# EAGLE schematic QuadQuantizer (EAGLE 8.7.0)

## Sheet 1 of 2
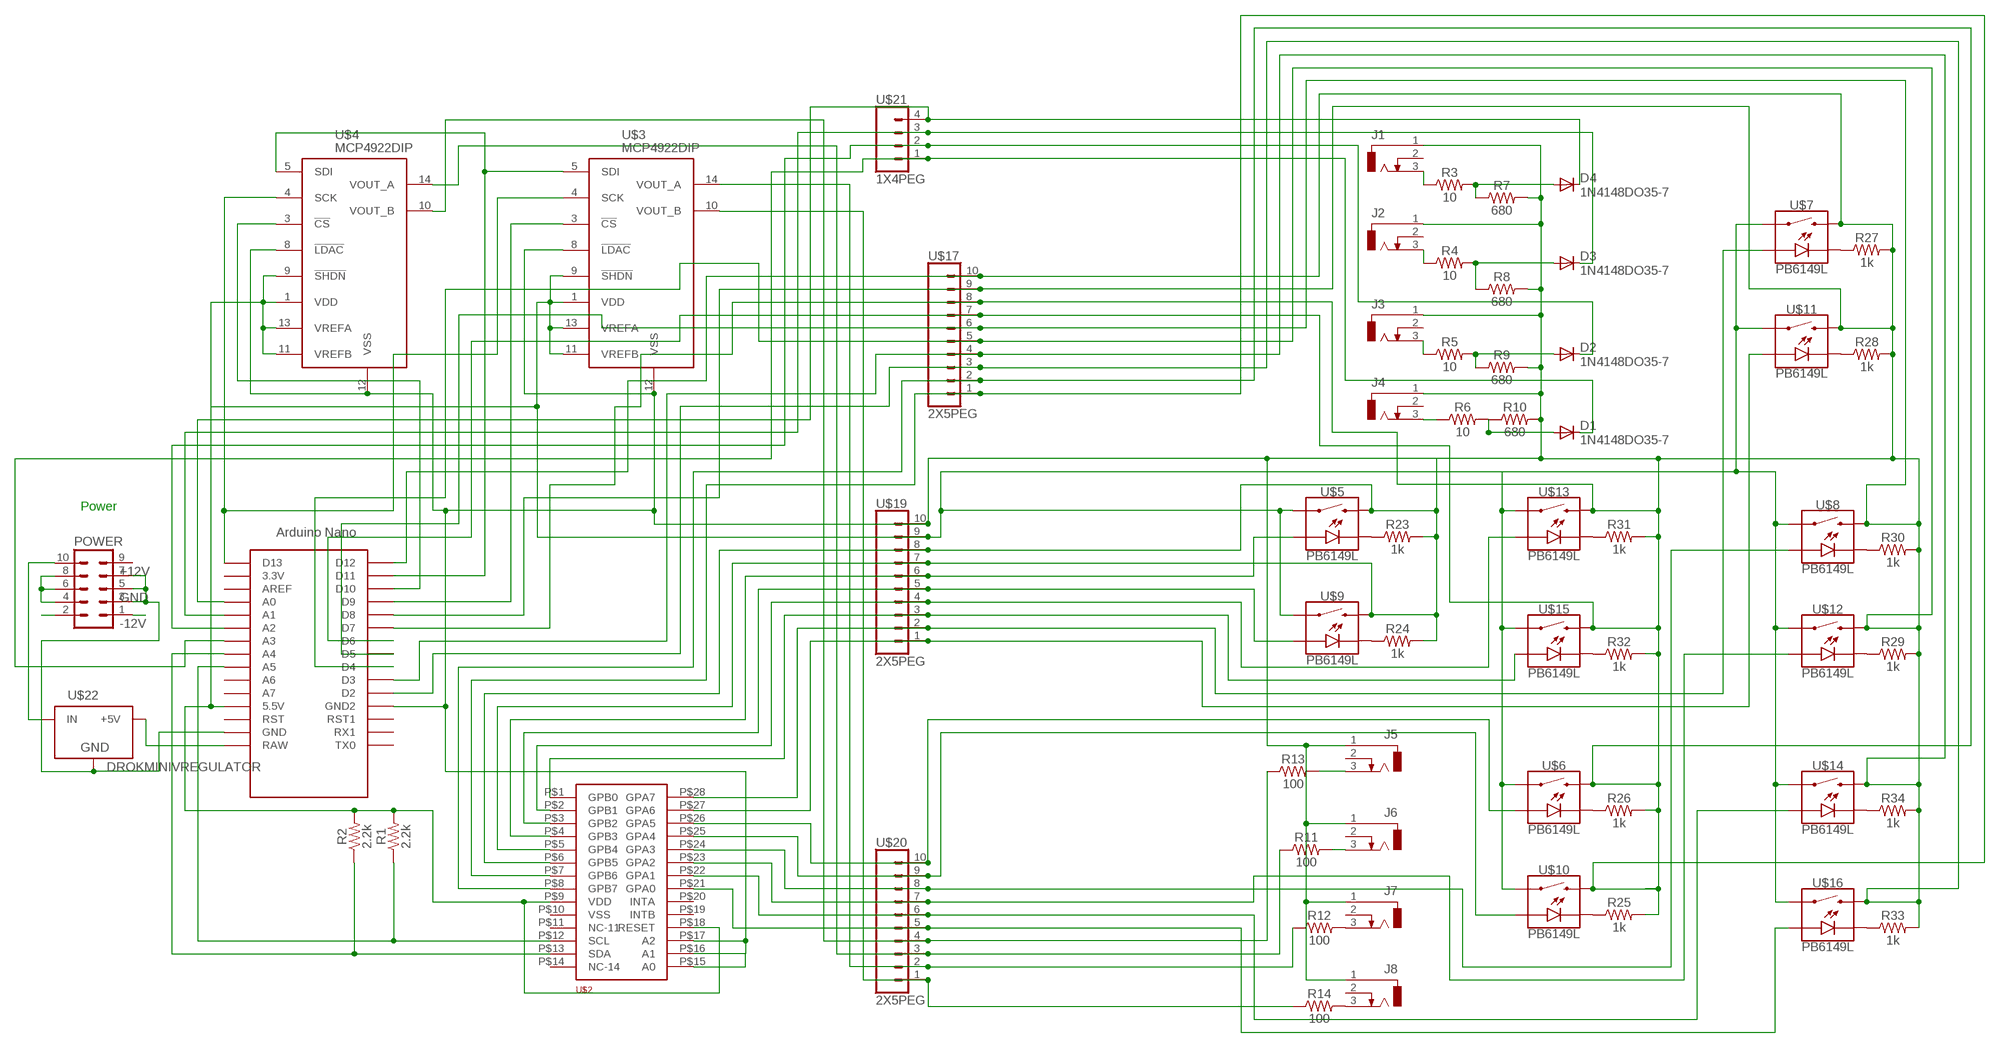
[diagram p0: schematic, sheet 1]

### Parts
D1  1N4148DO35-7  [DO35-7]
D2  1N4148DO35-7  [DO35-7]
D3  1N4148DO35-7  [DO35-7]
D4  1N4148DO35-7  [DO35-7]
J1  THONK35A  [THONK35A]
J2  THONK35A  [THONK35A]
J3  THONK35A  [THONK35A]
J4  THONK35A  [THONK35A]
J5  THONK35A  [THONK35A]
J6  THONK35A  [THONK35A]
J7  THONK35A  [THONK35A]
J8  THONK35A  [THONK35A]
POWER  10_PIN_HEADER  [MA05-2]
R1  2.2k  1KOHM-HORIZ-1/4W-1%  [AXIAL-0.3]
R2  2.2k  1KOHM-HORIZ-1/4W-1%  [AXIAL-0.3]
R3  10  10OHM-HORIZ-1/4W-1%  [AXIAL-0.3]
R4  10  10OHM-HORIZ-1/4W-1%  [AXIAL-0.3]
R5  10  10OHM-HORIZ-1/4W-1%  [AXIAL-0.3]
R6  10  10OHM-HORIZ-1/4W-1%  [AXIAL-0.3]
R7  680  10OHM-HORIZ-1/4W-1%  [AXIAL-0.3]
R8  680  10OHM-HORIZ-1/4W-1%  [AXIAL-0.3]
R9  680  10OHM-HORIZ-1/4W-1%  [AXIAL-0.3]
R10  680  10OHM-HORIZ-1/4W-1%  [AXIAL-0.3]
R11  100  100OHM-HORIZ-1/4W-1%  [AXIAL-0.3]
R12  100  100OHM-HORIZ-1/4W-1%  [AXIAL-0.3]
R13  100  100OHM-HORIZ-1/4W-1%  [AXIAL-0.3]
R14  100  100OHM-HORIZ-1/4W-1%  [AXIAL-0.3]
R23  1k  1KOHM-HORIZ-1/4W-1%  [AXIAL-0.3]
R24  1k  1KOHM-HORIZ-1/4W-1%  [AXIAL-0.3]
R25  1k  1KOHM-HORIZ-1/4W-1%  [AXIAL-0.3]
R26  1k  1KOHM-HORIZ-1/4W-1%  [AXIAL-0.3]
R27  1k  1KOHM-HORIZ-1/4W-1%  [AXIAL-0.3]
R28  1k  1KOHM-HORIZ-1/4W-1%  [AXIAL-0.3]
R29  1k  1KOHM-HORIZ-1/4W-1%  [AXIAL-0.3]
R30  1k  1KOHM-HORIZ-1/4W-1%  [AXIAL-0.3]
R31  1k  1KOHM-HORIZ-1/4W-1%  [AXIAL-0.3]
R32  1k  1KOHM-HORIZ-1/4W-1%  [AXIAL-0.3]
R33  1k  1KOHM-HORIZ-1/4W-1%  [AXIAL-0.3]
R34  1k  1KOHM-HORIZ-1/4W-1%  [AXIAL-0.3]
U$1  NANO  [NANO]
U$2  MCP23017-E/SP  [DIP28]
U$3  MCP4922DIP  [EDG-07]
U$4  MCP4922DIP  [EDG-07]
U$5  PB6149L  [PB6149L]
U$6  PB6149L  [PB6149L]
U$7  PB6149L  [PB6149L]
U$8  PB6149L  [PB6149L]
U$9  PB6149L  [PB6149L]
U$10  PB6149L  [PB6149L]
U$11  PB6149L  [PB6149L]
U$12  PB6149L  [PB6149L]
U$13  PB6149L  [PB6149L]
U$14  PB6149L  [PB6149L]
U$15  PB6149L  [PB6149L]
U$16  PB6149L  [PB6149L]
U$17  2X5PEG  [2X5]
U$19  2X5PEG  [2X5]
U$20  2X5PEG  [2X5]
U$21  1X4PEG  [1X04]
U$22  DROKMINIVREGULATOR  [1X04]

### Nets
+12V [power]: POWER.10 U$22.2(IN)
-12V [power]: POWER.1 POWER.2
GND [ground]: POWER.3 POWER.4 POWER.5 POWER.6 POWER.7 POWER.8 U$1.GND U$22.3(GND)
N$1: U$2.P$21(GPA0) U$16.P$2(A) U$20.5
N$3: J5.3 R13.P$2
N$4: D4.C U$1.A0 U$21.4
N$5: D3.C U$1.A1 U$21.3
N$6: U$1.RAW U$22.4(+5V)
N$7: U$1.D13 U$3.4(SCK) U$4.4(SCK)
N$8: J1.3 R3.P$1
N$9: D4.A R3.P$2 R7.P$1
N$10: J2.3 R4.P$1
N$11: D3.A R4.P$2 R8.P$1
N$12: D2.C U$1.A2 U$21.2
N$13: R14.P$1 U$3.10(VOUT_B) U$20.1
N$14: D1.C U$1.A3 U$21.1
N$15: R2.P$1 U$1.A4 U$2.P$13(SDA)
N$16: D2.A R5.P$2 R9.P$1
N$17: R1.P$1 U$1.A5 U$2.P$12(SCL)
N$18: D1.A R6.P$2 R10.P$1
N$19: J4.3 R6.P$1
N$20: J3.3 R5.P$1
N$21: R12.P$1 U$3.14(VOUT_A) U$20.2
N$22: R11.P$1 U$4.14(VOUT_A) U$20.3
N$23: J6.3 R11.P$2
N$24: R13.P$1 U$4.10(VOUT_B) U$20.4
N$25: U$1.D11 U$3.5(SDI) U$4.5(SDI)
N$26: R1.P$2 R2.P$2 U$1.5V(5.5V) U$2.P$9(VDD) U$2.P$18(RESET) U$3.1(VDD) U$3.9(!SHDN) U$3.11(VREFB) U$3.13(VREFA) U$4.1(VDD) U$4.9(!SHDN) U$4.11(VREFB) U$4.13(VREFA) U$5.P$1 U$6.P$1 U$7.P$1 U$8.P$1 U$9.P$1 U$10.P$1 U$11.P$1 U$12.P$1 U$13.P$1 U$14.P$1 U$15.P$1 U$16.P$1 U$19.9
N$27: J7.3 R12.P$2
N$28: U$1.D10 U$4.3(!CS)
N$29: U$1.D9 U$3.3(!CS)
N$30: J8.3 R14.P$2
N$33: U$2.P$22(GPA1) U$14.P$2(A) U$20.6
N$34: J1.1 J2.1 J3.1 J4.1 J5.1 J6.1 J7.1 J8.1 R7.P$2 R8.P$2 R9.P$2 R10.P$2 R23.P$2 R24.P$2 R25.P$2 R26.P$2 R27.P$2 R28.P$2 R29.P$2 R30.P$2 R31.P$2 R32.P$2 R33.P$2 R34.P$2 U$1.D2 U$1.D3 U$1.D4 U$1.D5 U$1.D6 U$1.D7 U$1.D8 U$1.D12 U$1.GND1(GND2) U$2.P$5(GPB4) U$2.P$6(GPB5) U$2.P$7(GPB6) U$2.P$8(GPB7) U$2.P$15(A0) U$2.P$16(A1) U$2.P$17(A2) U$3.8(!LDAC) U$3.12(VSS) U$4.8(!LDAC) U$4.12(VSS) U$5.P$3 U$6.P$3 U$7.P$3 U$8.P$3 U$9.P$3 U$10.P$3 U$11.P$3 U$12.P$3 U$13.P$3 U$14.P$3 U$15.P$3 U$16.P$3 U$17.1 U$17.2 U$17.3 U$17.4 U$17.5 U$17.6 U$17.7 U$17.8 U$17.9 U$17.10 U$19.7 U$19.8 U$19.10
N$40: R23.P$1 U$5.P$5(C)
N$41: R24.P$1 U$9.P$5(C)
N$42: R25.P$1 U$10.P$5(C)
N$43: R26.P$1 U$6.P$5(C)
N$44: R27.P$1 U$7.P$5(C)
N$45: R28.P$1 U$11.P$5(C)
N$46: R29.P$1 U$12.P$5(C)
N$47: R30.P$1 U$8.P$5(C)
N$48: R31.P$1 U$13.P$5(C)
N$49: R32.P$1 U$15.P$5(C)
N$50: R33.P$1 U$16.P$5(C)
N$51: R34.P$1 U$14.P$5(C)
N$53: U$2.P$23(GPA2) U$12.P$2(A) U$20.7
N$54: U$2.P$24(GPA3) U$8.P$2(A) U$20.8
N$55: U$2.P$25(GPA4) U$10.P$2(A) U$20.9
N$56: U$2.P$26(GPA5) U$6.P$2(A) U$20.10
N$57: U$2.P$27(GPA6) U$11.P$2(A) U$19.1
N$58: U$2.P$28(GPA7) U$7.P$2(A) U$19.2
N$59: U$2.P$1(GPB0) U$15.P$2(A) U$19.3
N$60: U$2.P$2(GPB1) U$13.P$2(A) U$19.4
N$61: U$2.P$3(GPB2) U$9.P$2(A) U$19.5
N$62: U$2.P$4(GPB3) U$5.P$2(A) U$19.6
Unconnected: J1.2 J2.2 J3.2 J4.2 J5.2 J6.2 J7.2 J8.2 POWER.9 U$1.3.3V U$1.A6 U$1.A7 U$1.AREF U$1.ICSP1 U$1.ICSP2 U$1.ICSP3 U$1.ICSP4 U$1.ICSP5 U$1.ICSP6 U$1.RST U$1.RST1 U$1.RX1 U$1.TX0 U$2.P$10(VSS) U$2.P$11(NC-11) U$2.P$14(NC-14) U$2.P$19(INTB) U$2.P$20(INTA)

### Notes on the sheet
- Power

## Sheet 2 of 2

## Library data of the parts
D1-D4 = diode:1N4148: DIODE high speed (Philips)
J1-J8 = nw2s:THONK35A: Thonkiconn 3.5mm Switching Jack by nw2s.net for thonk.co.uk; OC_FARNELL: unknown; OC_NEWARK: unknown
POWER = TomW:10_PIN_HEADER: PIN HEADER; OC_FARNELL: unknown; OC_NEWARK: unknown
R1 R2 = SparkFun-Resistors:1KOHM: 1kΩ resistor A resistor is a passive two-terminal electrical component that implements electrical resistance as a circuit element. Resistors act to reduce current flow, and, at the same time, act to lower voltage levels within circuits. - Wikipedia; PROD_ID: RES-12182; VALUE: 1k
R3-R6 = SparkFun-Resistors:10OHM: 10Ω resistor A resistor is a passive two-terminal electrical component that implements electrical resistance as a circuit element. Resistors act to reduce current flow, and, at the same time, act to lower voltage levels within circuits. - Wikipedia; PROD_ID: RES-12180
R7-R10 = SparkFun-Resistors:10OHM: 10Ω resistor A resistor is a passive two-terminal electrical component that implements electrical resistance as a circuit element. Resistors act to reduce current flow, and, at the same time, act to lower voltage levels within circuits. - Wikipedia; PROD_ID: RES-12180; VALUE: 10
R11-R14 = SparkFun-Resistors:100OHM: 100Ω resistor A resistor is a passive two-terminal electrical component that implements electrical resistance as a circuit element. Resistors act to reduce current flow, and, at the same time, act to lower voltage levels within circuits. - Wikipedia; PROD_ID: RES-12181
R23-R34 = SparkFun-Resistors:1KOHM: 1kΩ resistor A resistor is a passive two-terminal electrical component that implements electrical resistance as a circuit element. Resistors act to reduce current flow, and, at the same time, act to lower voltage levels within circuits. - Wikipedia; PROD_ID: RES-12182
U$1 = Arduino-clone:NANO: Arduino Nano
U$2 = IO-Expanders:MCP23017-E/SP: MCP23017 16 pin IO Expander using I2C bus; MCP23017-ESP: DIP
U$3 U$4 = mcp4922DIP:MCP4922DIP
U$5-U$16 = LP10A1A:PB6149L
U$17 U$19 U$20 = LP10A1A:2X5PEG
U$21 = LP10A1A:1X4PEG
U$22 = DROKMINIVREGULATOR:DROKMINIVREGULATOR

## Net classes
1 power: width 0.61 mm
2 ground: width 0.61 mm